# EAGLE design MultiTB (EAGLE 9.5.1)

## Sheet 1 of 2
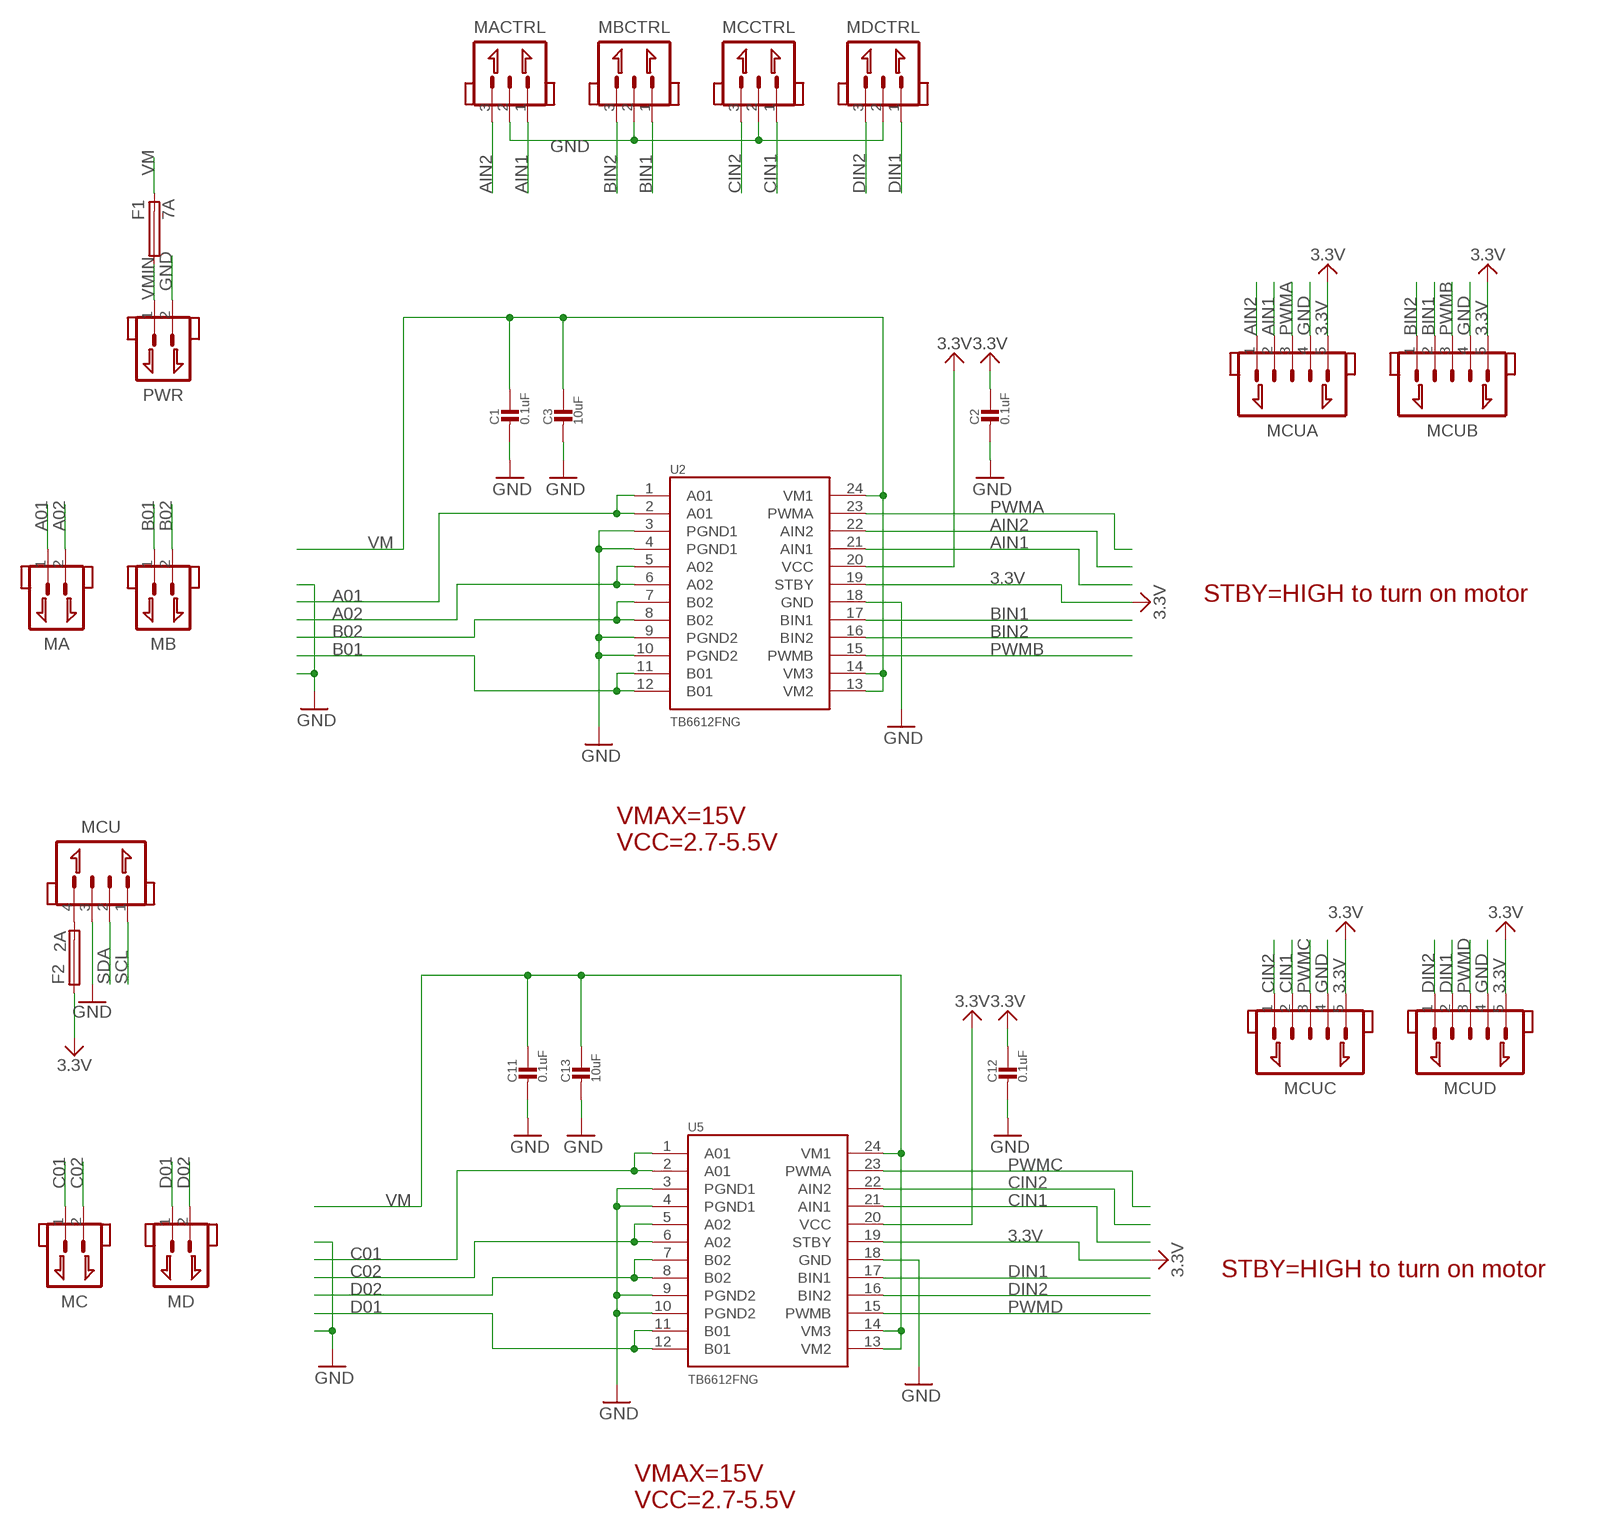
[diagram p0: schematic, sheet 1]

### Parts
C1  0.1uF  CAP_CERAMIC_0603  [0603]
C2  0.1uF  CAP_CERAMIC_0603  [0603]
C3  10uF  CAP_CERAMIC_0805  [0805]
C11  0.1uF  CAP_CERAMIC_0603  [0603]
C12  0.1uF  CAP_CERAMIC_0603  [0603]
C13  10uF  CAP_CERAMIC_0805  [0805]
F1  7A  FUSE-1206  [1206]
F2  2A  FUSE-0603  [0603]
MA  JST_XH_2.54_2P  [JST_XH_2.54_2P]
MACTRL  JST_1.25_3P  [JST1.25_3P]
MB  JST_XH_2.54_2P  [JST_XH_2.54_2P]
MBCTRL  JST_1.25_3P  [JST1.25_3P]
MC  JST_XH_2.54_2P  [JST_XH_2.54_2P]
MCCTRL  JST_1.25_3P  [JST1.25_3P]
MCU  JST_1.25_4P  [JST1.25_4P]
MCUA  JST_1.25_5P  [JST1.25_5P]
MCUB  JST_1.25_5P  [JST1.25_5P]
MCUC  JST_1.25_5P  [JST1.25_5P]
MCUD  JST_1.25_5P  [JST1.25_5P]
MD  JST_XH_2.54_2P  [JST_XH_2.54_2P]
MDCTRL  JST_1.25_3P  [JST1.25_3P]
PWR  JST_XH_2.54_2P  [JST_XH_2.54_2P]
U2  TB6612FNG  [SSOP24]
U5  TB6612FNG  [SSOP24]

### Nets
3.3V: C2.1 C12.1 F2.1 MCUA.5 MCUB.5 MCUC.5 MCUD.5 U2.19(STBY) U2.20(VCC) U5.19(STBY) U5.20(VCC) ; supply symbol labelled SUPPLY_3.3V ; also sheet 2
A01: MA.1 U2.1(A01) U2.2(A01)
A02: MA.2 U2.5(A02) U2.6(A02)
AIN1: MACTRL.1 MCUA.2 U2.21(AIN1)
AIN2: MACTRL.3 MCUA.1 U2.22(AIN2)
B01: MB.1 U2.11(B01) U2.12(B01)
B02: MB.2 U2.7(B02) U2.8(B02)
BIN1: MBCTRL.1 MCUB.2 U2.17(BIN1)
BIN2: MBCTRL.3 MCUB.1 U2.16(BIN2)
C01: MC.1 U5.1(A01) U5.2(A01)
C02: MC.2 U5.5(A02) U5.6(A02)
CIN1: MCCTRL.1 MCUC.2 U5.21(AIN1)
CIN2: MCCTRL.3 MCUC.1 U5.22(AIN2)
D01: MD.1 U5.11(B01) U5.12(B01)
D02: MD.2 U5.7(B02) U5.8(B02)
DIN1: MCUD.2 MDCTRL.1 U5.17(BIN1)
DIN2: MCUD.1 MDCTRL.3 U5.16(BIN2)
GND: C1.2 C2.2 C3.2 C11.2 C12.2 C13.2 MACTRL.2 MBCTRL.2 MCCTRL.2 MCU.3 MCUA.4 MCUB.4 MCUC.4 MCUD.4 MDCTRL.2 PWR.2 U2.3(PGND1) U2.4(PGND1) U2.9(PGND2) U2.10(PGND2) U2.18(GND) U5.3(PGND1) U5.4(PGND1) U5.9(PGND2) U5.10(PGND2) U5.18(GND) ; supply symbol labelled SUPPLY_GND ; also sheet 2
N$2: F2.2 MCU.4
PWMA: MCUA.3 U2.23(PWMA) ; also sheet 2
PWMB: MCUB.3 U2.15(PWMB) ; also sheet 2
PWMC: MCUC.3 U5.23(PWMA) ; also sheet 2
PWMD: MCUD.3 U5.15(PWMB) ; also sheet 2
SCL: MCU.1 ; also sheet 2
SDA: MCU.2 ; also sheet 2
VM: C1.1 C3.1 C11.1 C13.1 F1.2 U2.13(VM2) U2.14(VM3) U2.24(VM1) U5.13(VM2) U5.14(VM3) U5.24(VM1)
VMIN: F1.1 PWR.1

### Notes on the sheet
- STBY=HIGH to turn on motor
- VMAX=15V
  VCC=2.7-5.5V
- STBY=HIGH to turn on motor
- VMAX=15V
  VCC=2.7-5.5V

## Sheet 2 of 2
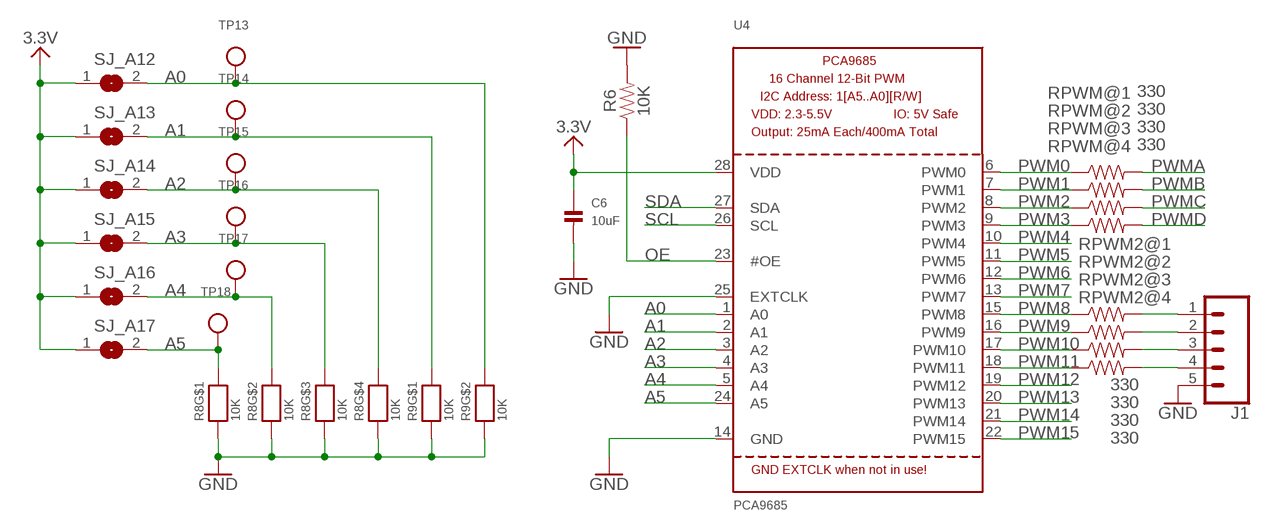
[diagram p1: schematic, sheet 2]

### Parts
C6  10uF  CAP_CERAMIC_0805  [0805]
J1  CONN_05  [1X05]
R6  10K  RESISTOR0603  [0603]
R8  10K  RESISTOR_4PACK  [RESPACK_4X0603]
R9  10K  RESISTOR_4PACK  [RESPACK_4X0603]
RPWM  330  RESISTOR_ARRAY_1206_SEPARATE_REVERSE  [RESCAF80P320X160X60-8N]
RPWM2  330  RESISTOR_ARRAY_1206_SEPARATE_REVERSE  [RESCAF80P320X160X60-8N]
SJ_A12  SOLDERJUMPERREFLOW_NOPASTE  [SOLDERJUMPER_REFLOW_NOPASTE]
SJ_A13  SOLDERJUMPERREFLOW_NOPASTE  [SOLDERJUMPER_REFLOW_NOPASTE]
SJ_A14  SOLDERJUMPERREFLOW_NOPASTE  [SOLDERJUMPER_REFLOW_NOPASTE]
SJ_A15  SOLDERJUMPERREFLOW_NOPASTE  [SOLDERJUMPER_REFLOW_NOPASTE]
SJ_A16  SOLDERJUMPERREFLOW_NOPASTE  [SOLDERJUMPER_REFLOW_NOPASTE]
SJ_A17  SOLDERJUMPERREFLOW_NOPASTE  [SOLDERJUMPER_REFLOW_NOPASTE]
TP13  TESTPOINTROUND2MM  [TESTPOINT_ROUND_2MM]
TP14  TESTPOINTROUND2MM  [TESTPOINT_ROUND_2MM]
TP15  TESTPOINTROUND2MM  [TESTPOINT_ROUND_2MM]
TP16  TESTPOINTROUND2MM  [TESTPOINT_ROUND_2MM]
TP17  TESTPOINTROUND2MM  [TESTPOINT_ROUND_2MM]
TP18  TESTPOINTROUND2MM  [TESTPOINT_ROUND_2MM]
U4  PCA9685  [TSSOP28]

### Nets
3.3V: C6.1 SJ_A12.1 SJ_A13.1 SJ_A14.1 SJ_A15.1 SJ_A16.1 SJ_A17.1 U4.28(VDD) ; supply symbol labelled SUPPLY_3.3V ; also sheet 1
A0: R9.7 SJ_A12.2 TP13.P$1 U4.1(A0)
A1: R9.8 SJ_A13.2 TP14.P$1 U4.2(A1)
A2: R8.5 SJ_A14.2 TP15.P$1 U4.3(A2)
A3: R8.6 SJ_A15.2 TP16.P$1 U4.4(A3)
A4: R8.7 SJ_A16.2 TP17.P$1 U4.5(A4)
A5: R8.8 SJ_A17.2 TP18.P$1 U4.24(A5)
GND: C6.2 J1.5 R6.2 R8.1 R8.2 R8.3 R8.4 R9.1 R9.2 U4.14(GND) U4.25(EXTCLK) ; supply symbol labelled SUPPLY_GND ; also sheet 1
N$1: J1.1 RPWM2.1
N$3: J1.2 RPWM2.2
N$4: J1.3 RPWM2.3
N$5: J1.4 RPWM2.4
OE: R6.1 U4.23(#OE)
PWM0: RPWM.8 U4.6(PWM0)
PWM1: RPWM.7 U4.7(PWM1)
PWM2: RPWM.6 U4.8(PWM2)
PWM3: RPWM.5 U4.9(PWM3)
PWM4: U4.10(PWM4)
PWM5: U4.11(PWM5)
PWM6: U4.12(PWM6)
PWM7: U4.13(PWM7)
PWM8: RPWM2.8 U4.15(PWM8)
PWM9: RPWM2.7 U4.16(PWM9)
PWM10: RPWM2.6 U4.17(PWM10)
PWM11: RPWM2.5 U4.18(PWM11)
PWM12: U4.19(PWM12)
PWM13: U4.20(PWM13)
PWM14: U4.21(PWM14)
PWM15: U4.22(PWM15)
PWMA: RPWM.1 ; also sheet 1
PWMB: RPWM.2 ; also sheet 1
PWMC: RPWM.3 ; also sheet 1
PWMD: RPWM.4 ; also sheet 1
SCL: U4.26(SCL) ; also sheet 1
SDA: U4.27(SDA) ; also sheet 1
Unconnected: R9.3 R9.4 R9.5 R9.6

## Library data of the parts
C1-C3 C6 C11-C13 = Scott-Electrical:CAP_CERAMIC
F1 F2 = Scott-Electrical:FUSE
J1 = SparkFun-Connectors:CONN_05: Multi connection point. Often used as Generic Header-pin footprint for 0.1 inch spaced/style header connections On any of the 0.1 inch spaced packages, you can populate with these: Break Away Headers - Straight <https://www.sparkfun.com/products/116> (PRT-00116) Break Away Male Headers - Right Angle <https://www.sparkfun.com/products/553> (PRT-00553) Female Headers <https://www.sparkfun.com/products/115> (PRT-00115) Break Away Headers - Machine Pin <https://www.sparkfun.com/products/117> (PRT-00117) Break Away Female Headers - Swiss Machine Pin <https://www.sparkfun.com/products/743> (PRT-00743) For SCREWTERMINALS and SPRING TERMINALS visit here: Screw Terimnals on SparkFun.com <https://www.sparkfun.com/search/results?term=Screw+Terminals> (5mm/3.5mm/2.54mm spacing) This device is also useful as a general connection point to wire up your design to another part of your project. Our various solder wires solder well into these plated through hole pads. Hook-Up Wire - Assortment (Stranded, 22 AWG) <https://www.sparkfun.com/products/11375> (PRT-11375) Hook-Up Wire - Assortment (Solid Core, 22 AWG) <https://www.sparkfun.com/products/11367> (PRT-11367) View the entire wire category on our website here <https://www.sparkfun.com/categories/141> Special notes: Molex polarized connector foot print use with SKU : PRT-08231 with associated crimp pins and housings. 1MM SMD Version SKU: PRT-10208
MA MB MC MD PWR = Scott-Connectors:JST_XH_2.54_2P
MACTRL MBCTRL MCCTRL MDCTRL = Scott-Connectors:JST_1.25_3P
MCU = Scott-Connectors:JST_1.25_4P
MCUA MCUB MCUC MCUD = Scott-Connectors:JST_1.25_5P
R6 = Scott-Electrical:RESISTOR: Generic Resistor Package
R8 R9 = microbuilder:RESISTOR_4PACK: Resistor Packs (4 resistors) 4 x 0603 10K 1/16W - Digikey: YC164J-10KCT-ND
RPWM RPWM2 = Scott-Electrical:RESISTOR_ARRAY_1206_SEPARATE
SJ_A12-SJ_A17 = microbuilder:SOLDERJUMPER: SMD Solder JUMPER Solder the two pads together to create a connection, or remove the solder to break it. REFLOW - Use this footprint for solder paste and reflow ovens. WAVE - Use this footprint for hand-soldering (larger pads). CLOSED - Has a trace between the two pads to ensure it is closed by default. The trace needs to be cut to disable the jumper, and can be closed again by creating a solder bridge between the two pads.
TP13-TP18 = microbuilder:TESTPOINT: Test Point Various test points for characterisation and PCB testing TESTPOINT_SMT - Compact Surface Mount Test Point [Digikey: 5016KTR-ND]
U2 U5 = SparkFun-IC-Special-Function:TB6612FNG: Toshiba 1A dual motor driver IC-09363; PROD_ID: IC-09363
U4 = microbuilder:PCA9685: PCA9685 - 16 Channel 12-Bit I2C PWM Controller 5.0V tolerant 16 channel, 12-bit I2C PWM controller with 25mA per output (max. 400mA total) Digikey: 568-5931-1-ND

## Board
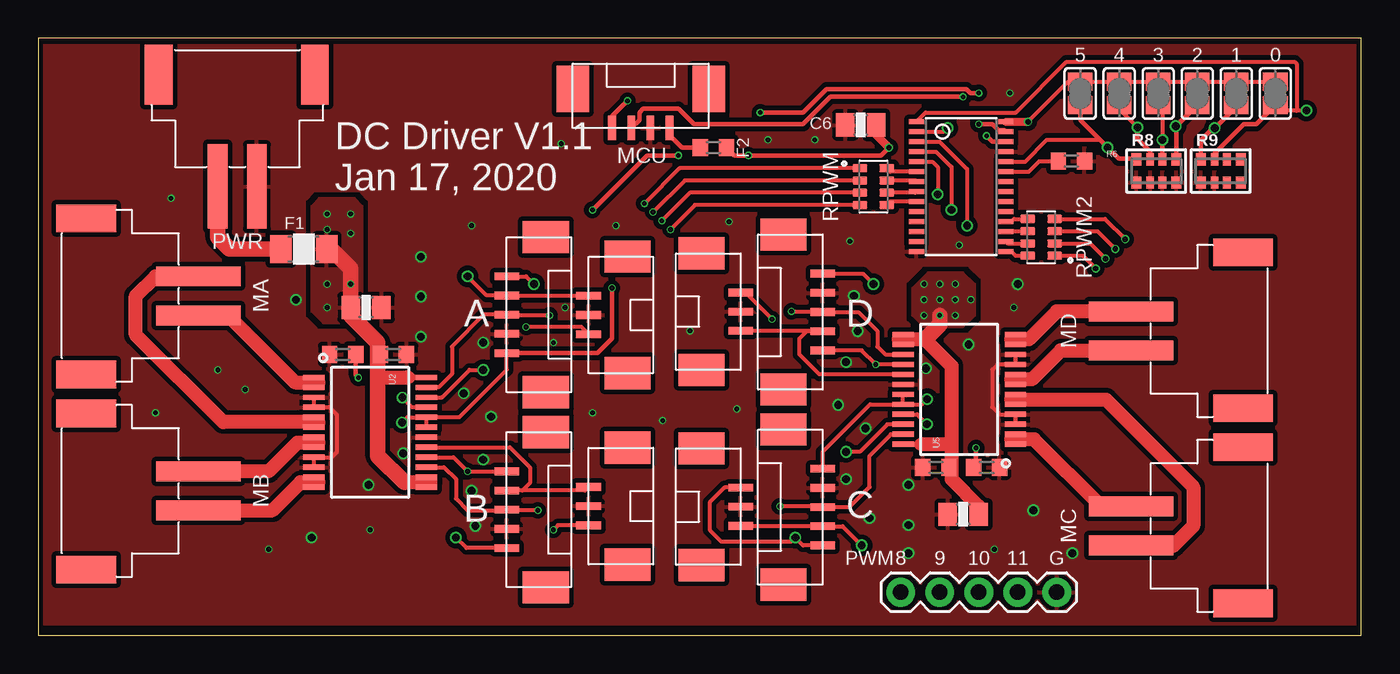
[diagram p2: board, top side]
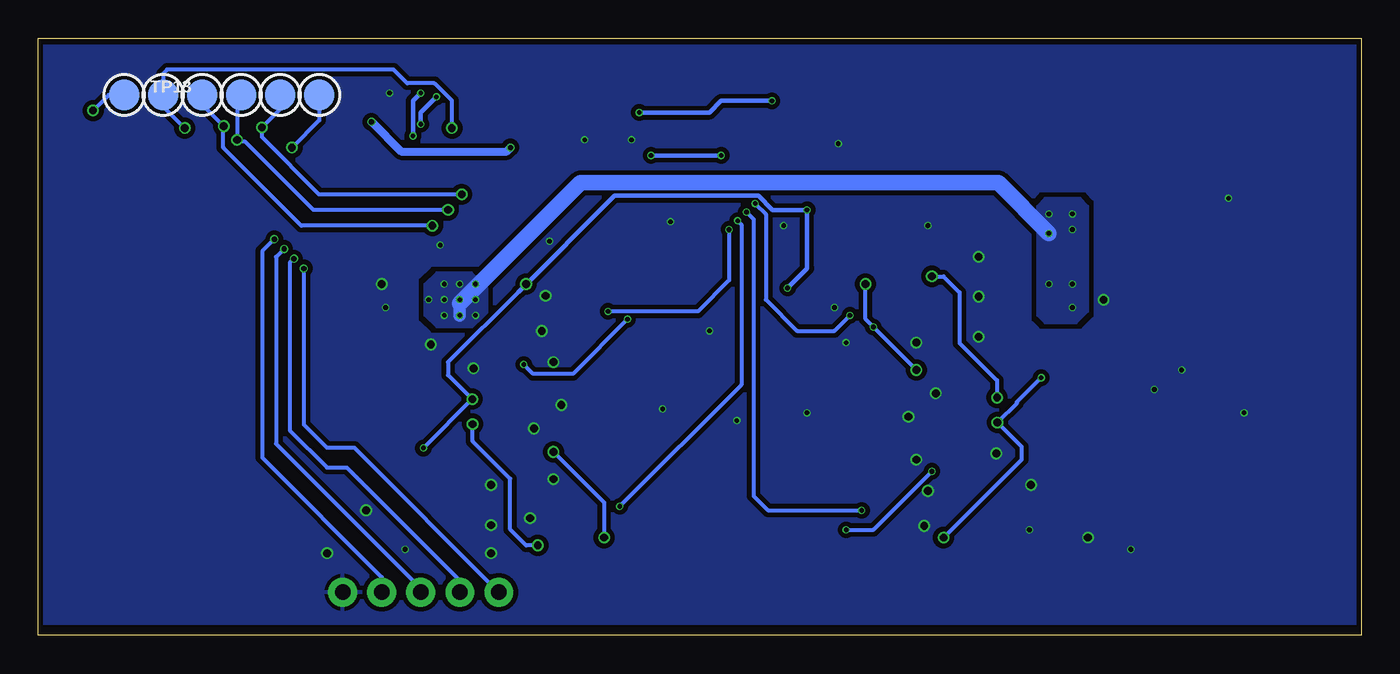
[diagram p3: board, bottom side, seen from below]

Size 86.11 x 38.86 mm. Coordinates in mm from the lower left corner, seen from the top.
Outline: 0,38.86 0,0 86.11,0 86.11,38.86 0,38.86
Copper layers (1*16): Top 0.035559375mm / dielectric 1.6mm / Bottom 0.035559375mm
Design rules "jlcpcb2layer": minimum track width 5mil, minimum drill 12mil, track to track 5mil, track to pad 5mil, pad to pad 5mil, via to via 5mil, smd to smd 5mil, copper to edge 8mil, drill to drill 6mil, minimum pad ring 5mil, minimum via ring 3mil, stop-mask expansion 2.5mil, vias tented up to drill 20mil, thermal gap 10mil

### Footprints (pad centres in the part's own frame; a part is rotated, then mirrored left to right if it is on the bottom)
0603 = smd 1 x 1.1: 1 -0.85,0; 2 0.85,0
0805 = smd 1.2 x 1.5: 1 -1,0; 2 1,0
1206 = smd 1.4 x 1.803: 1 -1.5,0; 2 1.5,0
1X05 = drill 1.016 pad 1.88: 1 0,0; 2 2.54,0; 3 5.08,0; 4 7.62,0; 5 10.16,0
JST_XH_2.54_2P = smd 1.3 x 5.5: 1 -1.27,-5.334; 2 1.27,-5.334 | smd 1.8 x 3.9: NC@1 -5.12,1.966; NC@2 5.04,1.966
JST1.25_3P = smd 0.5 x 1.6: 1 0,0; 2 1.25,0; 3 2.5,0 | smd 2.1 x 3: 4 -2.55,2.55; 5 5.05,2.55
JST1.25_4P = smd 0.5 x 1.6: 1 0,0; 2 1.25,0; 3 2.5,0; 4 3.75,0 | smd 2.1 x 3: 5 -2.55,2.55; 6 6.3,2.55
JST1.25_5P = smd 0.5 x 1.6: 1 0,0; 2 1.25,0; 3 2.5,0; 4 3.75,0; 5 5,0 | smd 2.1 x 3: 6 -2.55,2.55; 7 7.55,2.55
RESPACK_4X0603 = smd 0.65 x 0.8: 1 -1.3,-0.75; 4 1.3,-0.75; 5 1.3,0.75; 8 -1.3,0.75 | smd 0.5 x 0.8: 2 -0.4,-0.75; 3 0.4,-0.75; 6 0.4,0.75; 7 -0.4,0.75
RESCAF80P320X160X60-8N = smd 0.97 x 0.53: 1 -0.875,1.2; 2 -0.875,0.4; 3 -0.875,-0.4; 4 -0.875,-1.2; 5 0.875,-1.2; 6 0.875,-0.4; 7 0.875,0.4; 8 0.875,1.2
SOLDERJUMPER_REFLOW_NOPASTE = smd 1.168 x 1.6: 1 -0.762,0; 2 0.762,0
TESTPOINT_ROUND_2MM = smd 2 x 2: P$1 0,0
SSOP24 = smd 0.348 x 1.397: 1 -3.575,-3.656; 2 -2.925,-3.656; 3 -2.275,-3.656; 4 -1.625,-3.656; 5 -0.975,-3.656; 6 -0.325,-3.656; 7 0.325,-3.656; 8 0.975,-3.656; 9 1.625,-3.656; 10 2.275,-3.656; 11 2.925,-3.656; 12 3.575,-3.656; 13 3.575,3.656; 14 2.925,3.656; 15 2.275,3.656; 16 1.625,3.656; 17 0.975,3.656; 18 0.325,3.656; 19 -0.325,3.656; 20 -0.975,3.656; 21 -1.625,3.656; 22 -2.275,3.656; 23 -2.925,3.656; 24 -3.575,3.656
TSSOP28 = smd 0.305 x 0.991: 1 -4.225,-2.918; 2 -3.575,-2.918; 3 -2.925,-2.918; 4 -2.275,-2.918; 5 -1.625,-2.918; 6 -0.975,-2.918; 7 -0.325,-2.918; 8 0.325,-2.918; 9 0.975,-2.918; 10 1.625,-2.918; 11 2.275,-2.918; 12 2.925,-2.918; 13 3.575,-2.918; 14 4.225,-2.918; 15 4.225,2.918; 16 3.575,2.918; 17 2.925,2.918; 18 2.275,2.918; 19 1.625,2.918; 20 0.975,2.918; 21 0.325,2.918; 22 -0.325,2.918; 23 -0.975,2.918; 24 -1.625,2.918; 25 -2.275,2.918; 26 -2.925,2.918; 27 -3.575,2.918; 28 -4.225,2.918

### Placement (x,y rotation side)
C1  23.11,18.29 0 top
C2  19.81,18.29 180 top
C3  21.34,21.34 0 top
C6  53.53,33.23 180 top
C11  58.42,10.92 180 top
C12  61.72,10.92 0 top
C13  60.2,7.87 180 top
F1  17.27,25.15 0 top
F2  43.94,31.75 180 top
J1  56.13,2.79 0 top
MA  5.08,22.1 90 top
MACTRL  35.81,22.1 270 top
MB  5.08,9.4 90 top
MBCTRL  35.81,9.65 270 top
MC  76.45,7.11 270 top
MCCTRL  45.72,7.11 90 top
MCU  37.34,33.02 0 top
MCUA  30.48,23.37 270 top
MCUB  30.48,10.67 270 top
MCUC  51.05,5.84 90 top
MCUD  51.05,18.54 90 top
MD  76.45,19.81 270 top
MDCTRL  45.72,19.81 90 top
PWR  12.95,34.54 0 top
R6  67.25,30.86 0 top
R8  72.77,30.23 0 top
R9  76.96,30.23 0 top
RPWM  54.36,29.21 0 top
RPWM2  65.28,25.91 180 top
SJ_A12  80.52,35.27 270 top
SJ_A13  77.98,35.27 270 top
SJ_A14  75.44,35.27 270 top
SJ_A15  72.9,35.27 270 top
SJ_A16  70.36,35.27 270 top
SJ_A17  67.82,35.27 270 top
TP13  80.52,35.18 0 bottom
TP14  77.98,35.18 270 bottom
TP15  75.44,35.18 270 bottom
TP16  72.9,35.18 270 bottom
TP17  70.36,35.18 270 bottom
TP18  67.82,35.18 270 bottom
U2  21.59,13.21 270 top
U4  60.07,29.21 270 top
U5  59.94,16 90 top

### Tracks (layer width: path | path; a pad name or v marks a point on that pad's centre or on a via)
3.3V  (via drill 0.3, 0.35, 0.51)
  Top 0.254: U2.20 27.39,14.18 30.48,17.27 MCUA.5 | v23.67,13.84 24.01,14.18 U2.20 | v27.18,6.35 27.86,5.67 MCUB.5 | U5.20 57.52,15.03 v57.86,15.37 | U5.20 54.14,15.03 51.05,11.94 MCUC.5 | v54.36,22.86 53.67,23.54 MCUD.5 | 64.26,33.44 v64.42,33.44 67.02,36.04 SJ_A17.1 SJ_A16.1 SJ_A15.1 SJ_A14.1 SJ_A13.1 SJ_A12.1 | U2.20 U2.19 | U5.20 U5.19
  Top 0.305: MCUA.5 36.4,18.37 37.34,19.3 v37.34,22.61 | v36.07,27.69 39.62,31.24 v41.66,31.24 | v55.37,31.75 54.86,31.24 v46.23,31.24 45.3,31.24 F2.1 | v20.83,16.76 20.66,16.93 C2.1 | v61.04,12.19 61.04,11.09 C12.1
  Top 0.508: U4.28 64.26,33.44 | v55.37,31.75 54.53,32.59 C6.1
  Bottom 0.254: v20.83,16.76 22.42,15.18 22.42,15.1 v23.67,13.84 22.1,12.27 22.1,11.43 v27.18,6.35 | v61.04,12.19 v57.86,15.37 59.44,16.94 59.44,17.78 54.86,22.35 v54.36,22.86
  Bottom 0.305: v37.34,22.61 36.07,23.88 v36.07,27.69 38.3,27.69 39.24,28.62 48.59,28.62 54.86,22.35 | v41.66,31.24 v46.23,31.24
  Bottom 0.508: v64.42,33.44 62.48,31.5 55.63,31.5 v55.37,31.75
A0  (via drill 0.5)
  Top 0.254: U4.1 57.75,34.04 63.63,34.04 66.93,37.34 81.79,37.34 81.91,37.21 81.91,34.15 | 81.91,34.15 80.15,34.15 | v82.55,34.16 v82.55,34.15 81.91,34.15
  Top 0.305: R9.7 76.56,31.35 78.49,33.27 79.28,33.27 80.15,34.15 SJ_A12.2
  Bottom 0.254: TP13.P$1 81.53,35.18 v82.55,34.16
A01
  Top 0.254: U2.1 17.93,16.61 17.78,16.46 17.93,16.3 U2.2
  Top 0.914: 18.21,16.43 18.19,16.46 17.78,16.46 16.71,16.46 12.34,20.83 MA.1
A1  (via drill 0.5)
  Top 0.254: U4.2 58.91,32.78 59.14,33.02 v59.18,33.02
  Top 0.305: R9.8 75.66,32.23 76.45,33.02 v76.58,33.02 77.98,34.42 SJ_A13.2
  Bottom 0.254: v76.58,33.02 77.98,34.42 TP14.P$1 77.98,36.58 77.72,36.83 62.99,36.83 62.1,35.94 60.33,35.94 59.18,34.8 v59.18,33.02
A02
  Top 0.254: U2.5 17.93,14.02 17.78,13.87 17.93,13.71 U2.6
  Top 0.914: 18.21,13.84 18.19,13.87 17.78,13.87 12.04,13.87 6.35,19.56 6.35,22.1 7.62,23.37 MA.2
A2  (via drill 0.5)
  Top 0.254: U4.3 58.67,32.13 60.45,30.35 v60.45,26.67
  Top 0.305: R8.5 74.07,33.15 SJ_A14.2 75.41,34.51 v74.04,33.15
  Bottom 0.254: v60.45,26.67 68.99,26.67 74.07,31.75 74.07,33.12 v74.04,33.15 75.44,34.54 TP15.P$1
A3  (via drill 0.5)
  Top 0.254: U4.4 58.43,31.48 59.44,30.48 v59.44,27.69 | SJ_A15.2 73.17,34.24 v73.17,32.26
  Top 0.305: R8.6 v73.17,32.26
  Bottom 0.254: v59.44,27.69 68.2,27.69 72.64,32.13 73.04,32.13 v73.17,32.26 73.17,34.91 TP16.P$1
A4  (via drill 0.5)
  Top 0.254: U4.5 58.19,30.84 58.55,30.48 v58.55,28.7 | v71.55,33.07 70.36,34.26 SJ_A16.2
  Top 0.305: v71.55,33.07 71.55,32.34 72.39,31.5 72.39,30.99 R8.7
  Bottom 0.254: v58.55,28.7 67.82,28.7 71.55,32.43 v71.55,33.07 70.36,34.26 TP17.P$1
A5  (via drill 0.5)
  Top 0.254: U4.24 64.24,30.84 65.66,32.26 69.09,32.26
  Top 0.305: SJ_A17.2 67.82,33.53 69.09,32.26 v69.6,31.75 70.33,31.02 71.43,31.02 R8.8
  Bottom 0.254: TP18.P$1 67.82,33.53 v69.6,31.75
AIN1  (via drill 0.51)
  Top 0.254: U2.21 24.33,14.83 v23.7,15.47 | v27.94,23.37 29.19,22.12 MCUA.2 30.5,22.1 MACTRL.1
  Bottom 0.254: v23.7,15.47 23.7,16.59 26.14,19.02 26.14,22.33 27.18,23.37 v27.94,23.37
AIN2  (via drill 0.3, 0.51)
  Top 0.254: U2.22 26.28,15.48 28.07,17.27 v28.96,17.27 | MCUA.1 31.75,23.37 v32.26,22.86 | MACTRL.3 35.35,20.07 v31.75,20.07
  Bottom 0.254: v28.96,17.27 v31.75,20.07 32.26,20.57 v32.26,22.86
B01
  Top 0.254: U2.12 17.93,9.8 17.78,9.96 17.93,10.11 U2.11
  Top 0.914: 18.21,9.96 17.78,9.96 17.07,9.96 15.24,8.13 MB.1
B02
  Top 0.254: U2.8 17.93,12.39 17.78,12.55 17.93,12.7 U2.7
  Top 0.914: 18.21,12.55 17.78,12.55 16.87,12.55 14.99,10.67 MB.2
BIN1
  Top 0.254: 31.52,9.42 32,9.91 32,10.92 30.69,12.23 U2.17 | 31.52,9.42 30.99,9.42 MCUB.2 | MBCTRL.1 35.58,9.42 31.52,9.42
BIN2  (via drill 0.3)
  Top 0.254: U2.16 27.02,11.58 v27.94,10.67 MCUB.1 | MBCTRL.3 33.82,7.15 v33.53,6.86
  Bottom 0.254: v33.53,6.86 31.75,6.86 v27.94,10.67
C01
  Top 0.254: U5.1 63.6,12.6 63.75,12.75 63.6,12.9 U5.2
  Top 0.914: 63.32,12.78 63.35,12.75 63.75,12.75 64.82,12.75 69.19,8.38 MC.1
C02
  Top 0.254: U5.5 63.6,15.19 63.75,15.34 63.6,15.5 U5.6
  Top 0.914: 63.32,15.37 63.35,15.34 63.75,15.34 69.49,15.34 75.18,9.65 75.18,7.11 73.91,5.84 MC.2
CIN1  (via drill 0.51)
  Top 0.254: U5.21 57.2,14.38 v57.84,13.74 | v53.59,5.84 52.34,7.09 MCUC.2 45.74,7.09 MCCTRL.1
  Bottom 0.254: v57.84,13.74 57.84,12.62 55.4,10.18 55.4,6.88 54.36,5.84 v53.59,5.84
CIN2  (via drill 0.51)
  Top 0.254: U5.22 55.26,13.73 53.47,11.94 v52.58,11.94 | MCUC.1 49.78,5.84 v49.28,6.35 49.02,6.1 44.45,6.1 43.69,6.86 43.69,8.64 44.66,9.61 MCCTRL.3
  Bottom 0.254: v52.58,11.94 49.28,8.64 v49.28,6.35
D01
  Top 0.254: U5.12 63.6,19.41 63.75,19.25 63.6,19.1 U5.11
  Top 0.914: 63.32,19.25 63.75,19.25 64.47,19.25 66.29,21.08 MD.1
D02
  Top 0.254: U5.8 63.6,16.82 63.75,16.66 63.6,16.51 U5.7
  Top 0.914: 63.32,16.66 63.75,16.66 64.67,16.66 66.55,18.54 MD.2
DIN1
  Top 0.254: U5.17 50.84,16.98 49.53,18.29 49.53,19.3 50.02,19.79 MCUD.2 45.74,19.79 MDCTRL.1
DIN2  (via drill 0.3)
  Top 0.254: U5.16 v54.51,17.63 53.59,18.54 MCUD.1 | MDCTRL.3 46.01,22.31 v47.75,20.57
  Bottom 0.254: v47.75,20.57 51.31,17.02 53.9,17.02 v54.51,17.63
GND  (via drill 0.3, 0.51)
  Top 0.254: U2.10 U2.9 19.08,11.58 19.43,11.94 19.43,14.35 18.95,14.83 U2.4 U2.3 | U5.10 U5.9 62.46,17.63 62.1,17.27 62.1,14.86 62.59,14.38 U5.4 U5.3
  other vias: 23.75,11.84 24.89,19.43 21.49,9.78 24.89,22.05 28.96,19.05 28.45,7.11 28.19,9.4 27.69,15.75 28.96,11.43 16.76,21.84 24.89,24.64 17.78,6.35 29.46,14.22 57.78,17.37 56.64,9.78 60.55,18.92 56.64,7.16 52.58,10.16 53.09,22.1 53.34,19.81 53.85,13.46 52.58,17.78 64.77,8.13 67.31,5.33 56.64,5.33 63.75,22.86 52.07,14.99 54.1,7.62 36.07,14.48 45.47,14.73 62.23,5.59 63.5,21.34 63.25,35.31 34.04,32 28.19,26.67 8.64,28.45 11.68,17.27 13.46,16 7.62,14.48 14.99,5.59 21.59,6.86 40.64,13.97 42.42,19.81 37.59,26.67 44.96,26.92 47.5,32.26 50.55,32.26 52.83,25.65 59.94,25.4 34.29,21.34 33.53,19.05
  pour Top (isolate 0.305, rank 6): 0,0.76 90.17,0.76 90.17,38.35 0,38.35
  pour Bottom (isolate 0.305, rank 6): 0,0.76 90.17,0.76 90.17,38.35 0,38.35
N$1  (via drill 0.35)
  Top 0.254: v68.83,23.88 68,24.71 RPWM2.1
  Bottom 0.254: v68.83,23.88 68.83,13.72 67.31,12.19 65.53,12.19 J1.1
N$2
  Top 0.305: F2.2 41.91,31.75 41.09,32.57 MCU.4
N$3  (via drill 0.35)
  Top 0.254: v69.47,24.51 68.48,25.51 RPWM2.2
  Bottom 0.254: v69.47,24.51 | v69.47,24.51 69.74,24.25 69.74,13.34 67.31,10.92 66.04,10.92 58.67,3.56 J1.2
N$4  (via drill 0.35)
  Top 0.254: v70.11,25.15 68.95,26.31 RPWM2.3
  Bottom 0.254: v70.11,25.15 | v70.11,25.15 70.64,24.62 70.64,12.46 61.21,3.04 J1.3
N$5  (via drill 0.35)
  Top 0.254: v70.75,25.79 69.43,27.11 RPWM2.4
  Bottom 0.254: v70.75,25.79 | v70.75,25.79 71.54,25 71.54,11.56 63.75,3.78 J1.4
OE
  Top 0.254: U4.23 64.47,30.19 65.15,30.86 R6.1
PWM0
  Top 0.254: RPWM.8 55.46,30.19 U4.6
PWM1
  Top 0.254: RPWM.7 57.08,29.61 U4.7
PWM2
  Top 0.254: RPWM.6 57.08,28.81 U4.8
PWM3
  Top 0.254: RPWM.5 55.46,28.23 U4.9
PWM8
  Top 0.254: RPWM2.8 63.61,24.71 63.33,24.98 U4.15
PWM9
  Top 0.254: RPWM2.7 63.12,25.51 U4.16
PWM10
  Top 0.254: RPWM2.6 63.01,26.31 U4.17
PWM11
  Top 0.254: RPWM2.5 63.51,27.11 63.33,26.94 U4.18
PWMA  (via drill 0.3)
  Top 0.254: v39.45,28.11 41.75,30.41 RPWM.1 | v33.27,20.83 30.52,20.83 MCUA.3 29,20.87 26.92,18.8 26.92,17.02 26.04,16.13 U2.23
  Bottom 0.254: v39.45,28.11 38.75,27.41 38.75,21.84 36.72,19.81 34.29,19.81 v33.27,20.83
PWMB  (via drill 0.3)
  Top 0.254: v40.02,27.55 42.08,29.61 RPWM.2 | v32.51,8.13 30.52,8.13 | 30.52,8.13 MCUB.3 | U2.15 26.41,10.93 27.18,10.16 27.18,8.89 27.94,8.13 30.52,8.13
  Bottom 0.254: v40.02,27.55 39.55,27.08 39.55,9.07 38.61,8.13 v32.51,8.13
PWMC  (via drill 0.3)
  Top 0.254: v40.58,26.98 42.41,28.81 RPWM.3 | v48.26,8.38 51.01,8.38 MCUC.3 52.79,8.34 54.1,9.65 54.1,11.68 55.49,13.08 U5.23
  Bottom 0.254: v40.58,26.98 40.35,26.75 40.35,16.29 v48.26,8.38
PWMD  (via drill 0.3)
  Top 0.254: v41.15,26.42 42.74,28.01 RPWM.4 | v49.02,21.08 51.01,21.08 MCUD.3 53.38,21.04 54.61,19.81 54.61,18.8 55.13,18.28 U5.15
  Bottom 0.254: v41.15,26.42 41.15,23.11 43.18,21.08 v49.02,21.08
SCL  (via drill 0.3)
  Top 0.305: U4.26 62.1,32.13 v61.72,32.51 | v61.21,35.31 60.66,35.31 60.41,35.56 51.31,35.56 49.78,34.04 v46.99,34.04 | v38.35,34.8 37.34,33.78 MCU.1
  Bottom 0.305: v61.72,32.51 61.72,34.8 v61.21,35.31 | v46.99,34.04 42.42,34.04 41.66,34.8 v38.35,34.8
SDA  (via drill 0.3)
  Top 0.305: MCU.2 39.12,33.55 39.12,34.04 39.37,34.29 41.66,34.29 42.67,33.27 49.78,33.27 51.56,35.05 v60.2,35.05 | U4.27 62.87,32.9 62.48,32.9 62.11,33.27 v61.21,33.27
  Bottom 0.305: v60.2,35.05 61.21,34.04 v61.21,33.27
VM  (via drill 0.3)
  Top 0.254: 22.1,18.29 C1.1 | U2.14 25.25,10.11 25.4,9.96 25.25,9.8 U2.13 | 59.44,10.92 C11.1 | U5.14 56.29,19.1 56.13,19.25 56.29,19.41 U5.13
  Top 0.343: 24.14,16.78 24.13,16.79 | 57.4,12.43 57.4,12.42
  Top 0.348: U2.24 24.14,16.78 | U5.24 57.4,12.43
  Top 0.813: 24,16.79 24.13,16.79 | 57.53,12.42 57.4,12.42
  Top 0.914: 23.82,9.96 25.4,9.96 25.53,9.96 | 24,16.79 22.33,16.79 22.1,17.02 | 59.44,12.19 59.44,17.53 57.71,19.25 56.13,19.25 56.01,19.25 | 59.44,12.19 59.44,10.92 59.44,10.16 61.2,8.4 C13.1 | 57.53,12.42 59.21,12.42 59.44,12.19
  Top 1.016: 23.82,9.96 22.1,11.68 22.1,17.02 22.1,18.29 22.1,19.05 20.34,20.81 C3.1 20.34,23.86 19.05,25.15 F1.2 | v58.67,20.83 58.67,20.22 57.71,19.25
  Bottom 0.813: 58.67,21.59 v58.67,20.83
  Bottom 1.016: v20.32,26.16 23.62,29.46 50.8,29.46 58.67,21.59
  other vias: 18.8,27.43 20.32,27.43 18.8,26.42 18.8,22.86 18.8,21.34 20.32,22.86 57.66,20.83 59.69,20.83 59.69,21.84 58.67,21.84 57.66,21.84 58.67,22.86 59.69,22.86 60.71,21.84 57.66,22.86
  pour Top (isolate 0.305): 17.78,27.94 17.78,21.08 18.54,20.32 20.32,20.32 21.08,21.08 21.08,27.94 20.57,28.45 18.29,28.45
  pour Bottom (isolate 0.305): 17.78,27.94 18.29,28.45 20.57,28.45 21.08,27.94 21.08,27.69 21.08,20.83 20.57,20.32 18.54,20.32 17.78,21.08
  pour Bottom (isolate 0.305): 58.17,23.62 60.2,23.62 60.96,22.86 60.96,20.83 60.2,20.07 58.17,20.07 57.66,20.07 56.9,20.83 56.9,22.61 57.66,23.37 57.91,23.62
  pour Top (isolate 0.305): 57.91,23.62 60.2,23.62 60.96,22.86 60.96,20.83 60.2,20.07 57.66,20.07 56.9,20.83 56.9,22.61
VMIN
  Top 1.016: F1.1 12.45,25.15 11.68,25.91 PWR.1

### Text on the board
tPlace: 5 | 4 | 3 | 2 | 1 | 0 | DC Driver V1.1 / Jan 17, 2020 | A | D | B | C | PWM | 8 | 9 | 10 | 11 | G